# EAGLE schematic boatcc (EAGLE 9.2.1)
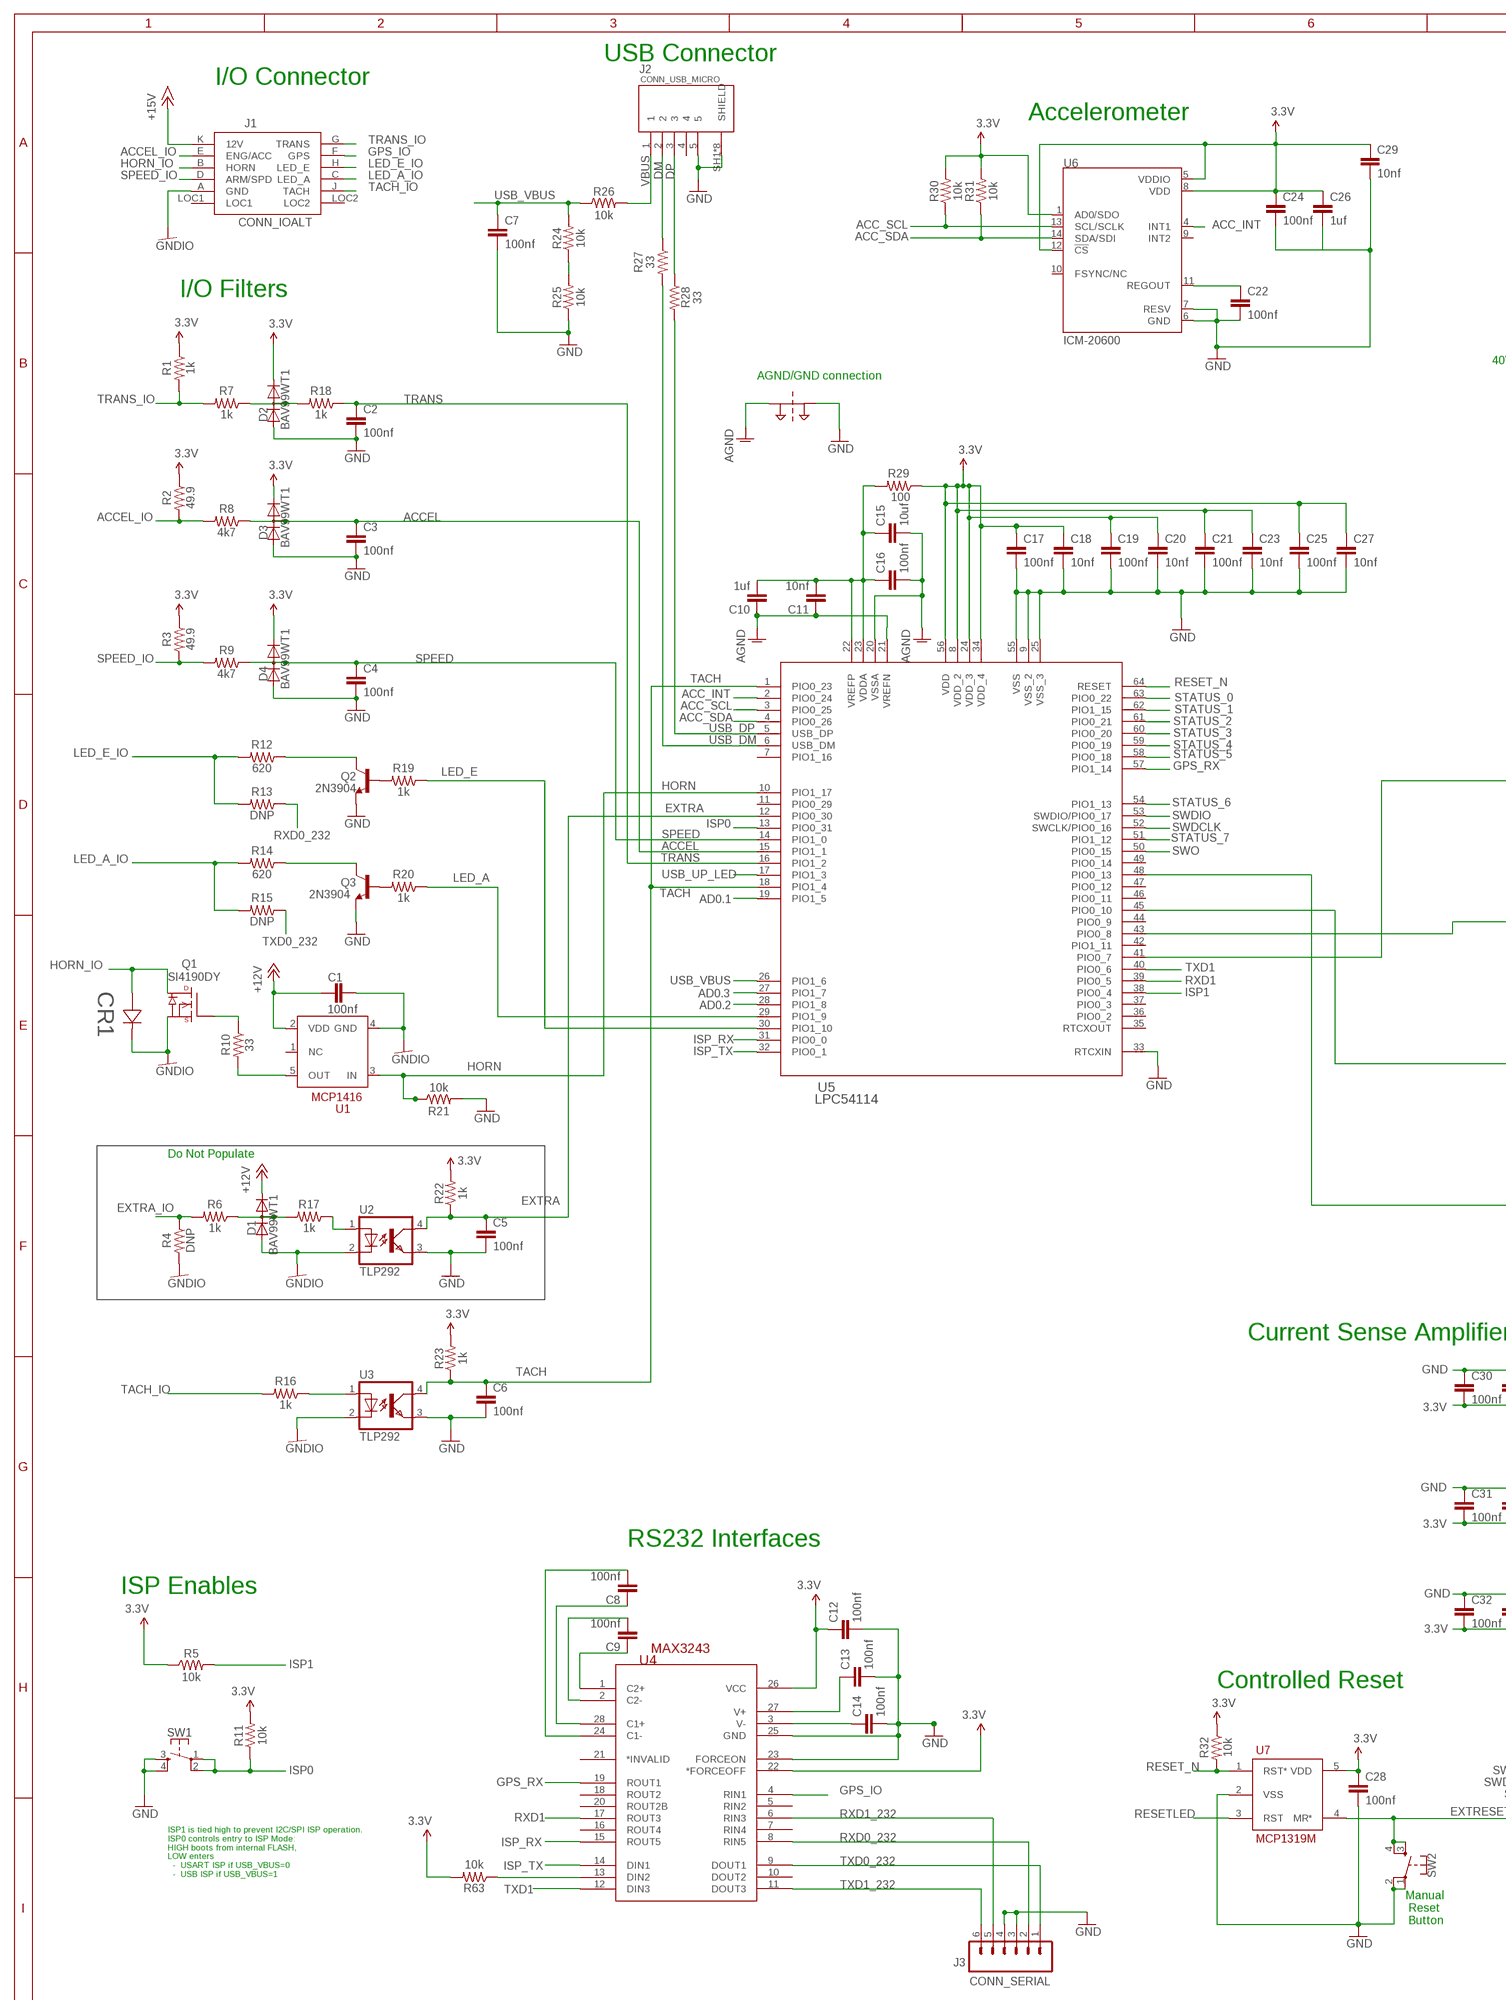
[diagram p0: schematic, sheet 1, part 1 of 2]
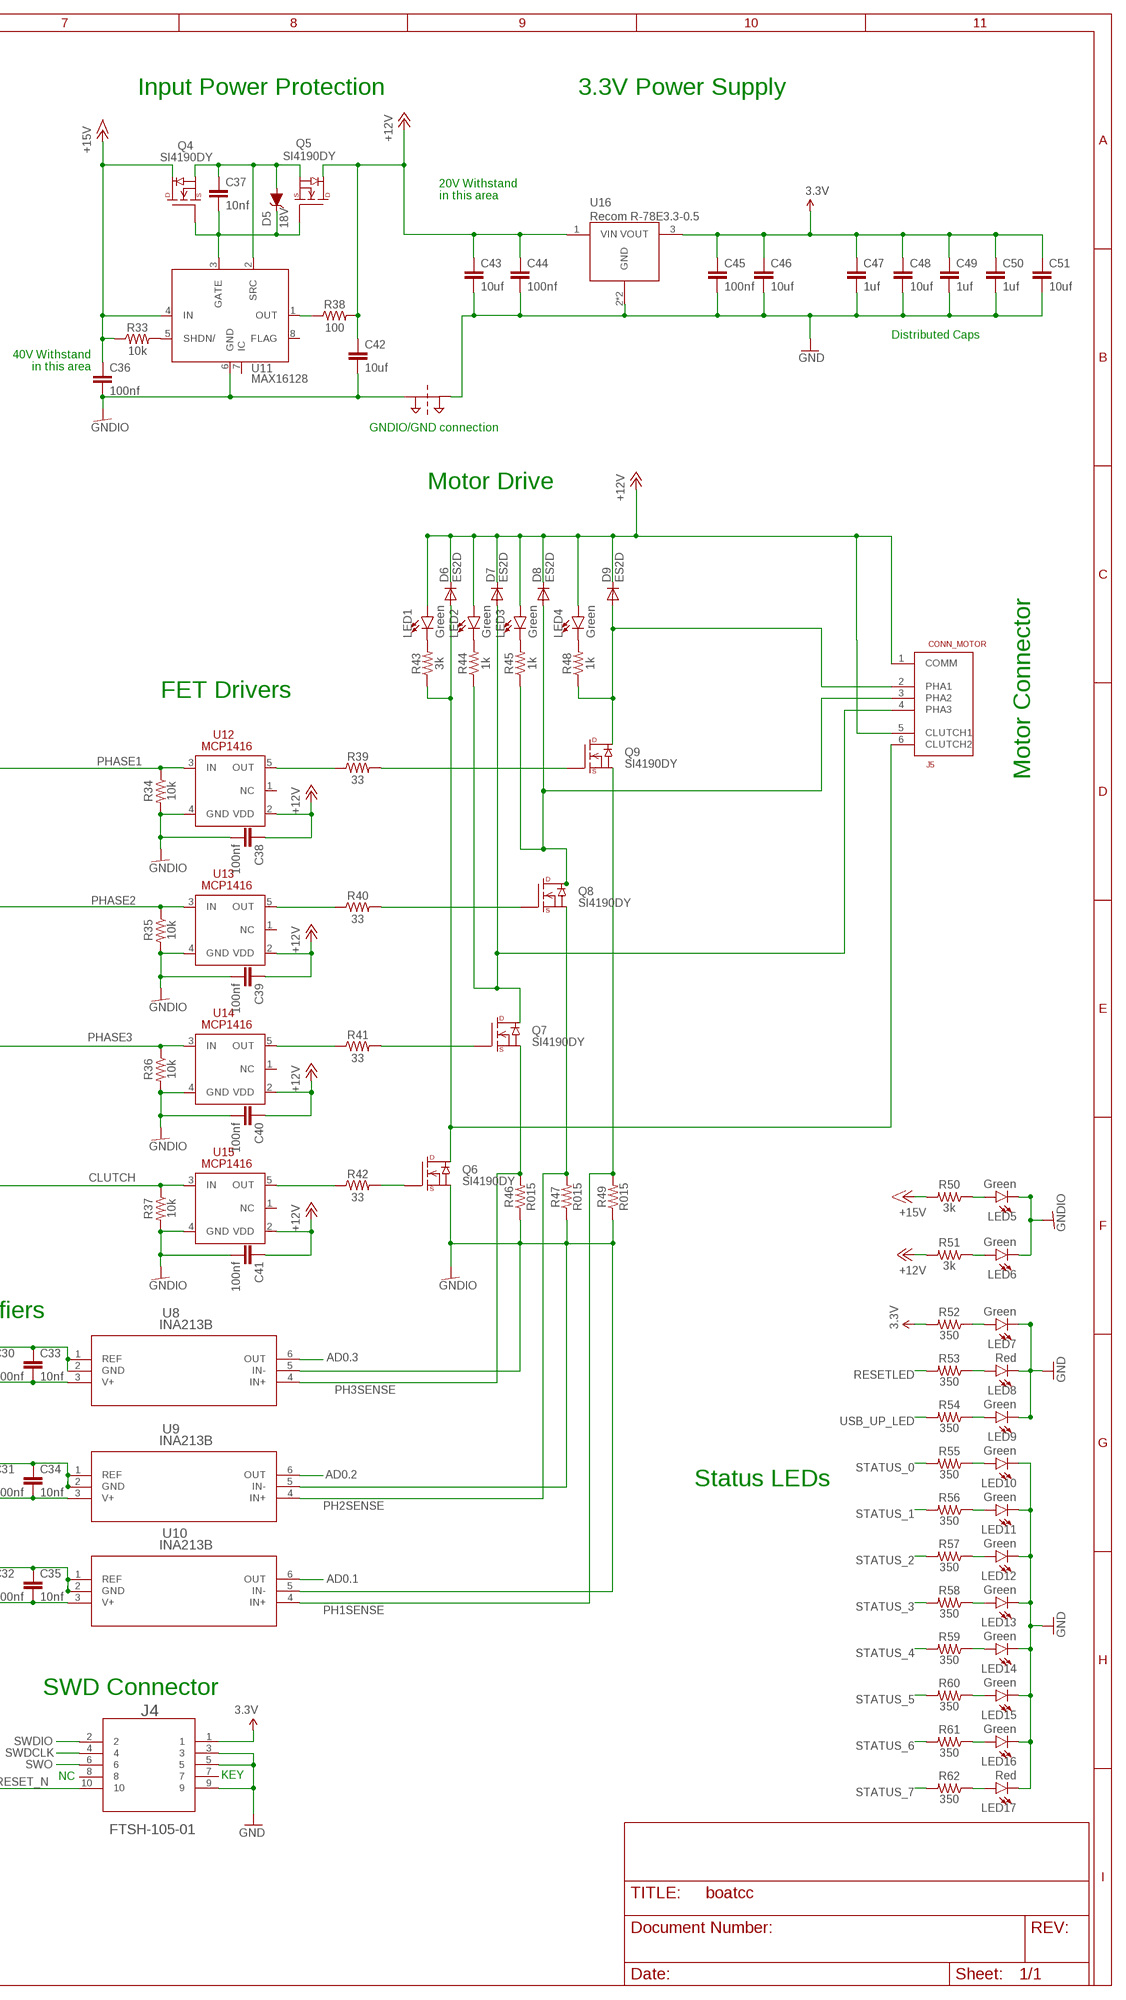
[diagram p1: schematic, sheet 1, part 2 of 2]

## Parts
C1  100nf  1CAP-0805  [0805]
C2  100nf  1CAP-0805  [0805]
C3  100nf  1CAP-0805  [0805]
C4  100nf  1CAP-0805  [0805]
C5  100nf  1CAP-0805  [0805]
C6  100nf  1CAP-0805  [0805]
C7  100nf  1CAP-0805  [0805]
C8  100nf  1CAP-0805  [0805]
C9  100nf  1CAP-0805  [0805]
C10  1uf  1CAP-0805  [0805]
C11  10nf  1CAP-0805  [0805]
C12  100nf  1CAP-0805  [0805]
C13  100nf  1CAP-0805  [0805]
C14  100nf  1CAP-0805  [0805]
C15  10uf  1CAP-0805  [0805]
C16  100nf  1CAP-0805  [0805]
C17  100nf  1CAP-0805  [0805]
C18  10nf  1CAP-0805  [0805]
C19  100nf  1CAP-0805  [0805]
C20  10nf  1CAP-0805  [0805]
C21  100nf  1CAP-0805  [0805]
C22  100nf  1CAP-0805  [0805]
C23  10nf  1CAP-0805  [0805]
C24  100nf  1CAP-0805  [0805]
C25  100nf  1CAP-0805  [0805]
C26  1uf  1CAP-0805  [0805]
C27  10nf  1CAP-0805  [0805]
C28  100nf  1CAP-0805  [0805]
C29  10nf  1CAP-0805  [0805]
C30  100nf  1CAP-0805  [0805]
C31  100nf  1CAP-0805  [0805]
C32  100nf  1CAP-0805  [0805]
C33  10nf  1CAP-0805  [0805]
C34  10nf  1CAP-0805  [0805]
C35  10nf  1CAP-0805  [0805]
C36  100nf  1CAP-0805  [0805]
C37  10nf  1CAP-0805  [0805]
C38  100nf  1CAP-0805  [0805]
C39  100nf  1CAP-0805  [0805]
C40  100nf  1CAP-0805  [0805]
C41  100nf  1CAP-0805  [0805]
C42  10uf  1CAP-0805  [0805]
C43  10uf  1CAP-0805  [0805]
C44  100nf  1CAP-0805  [0805]
C45  100nf  1CAP-0805  [0805]
C46  10uf  1CAP-0805  [0805]
C47  1uf  1CAP-0805  [0805]
C48  10uf  1CAP-0805  [0805]
C49  1uf  1CAP-0805  [0805]
C50  1uf  1CAP-0805  [0805]
C51  10uf  1CAP-0805  [0805]
CR1  SMAJ45CASMASERIES-M  [SMASERIES-M]
D1  BAV99WT1  [SC70]
D2  BAV99WT1  [SC70]
D3  BAV99WT1  [SC70]
D4  BAV99WT1  [SC70]
D5  18V  DIODE-ZENER-MM3Z3V3T1G  [SOD-323]
D6  ES2D  [SMB]
D7  ES2D  [SMB]
D8  ES2D  [SMB]
D9  ES2D  [SMB]
J1  CONN_IOALT  [CONN_IO]
J2  CONN_USB_MICRO  USB_MICRO  [MOLEX_1050170001]
J3  CONN_SERIAL  CONN_06LOCK  [1X06_LOCK]
J4  FTSH-105-01  SAMTEC-FTSH-105-01-X-DVJ  [SAMTEC-FTSH-105-01-X-DV]
J5  CONN_MOTOR  [CONN_MOTOR]
LED1  Green  1LED0805  [LED_0805]
LED2  Green  1LED0805  [LED_0805]
LED3  Green  1LED0805  [LED_0805]
LED4  Green  1LED0805  [LED_0805]
LED5  Green  1LED0805  [LED_0805]
LED6  Green  1LED0805  [LED_0805]
LED7  Green  1LED0805  [LED_0805]
LED8  Red  1LED0805  [LED_0805]
LED9  Green  1LED0805  [LED_0805]
LED10  Green  1LED0805  [LED_0805]
LED11  Green  1LED0805  [LED_0805]
LED12  Green  1LED0805  [LED_0805]
LED13  Green  1LED0805  [LED_0805]
LED14  Green  1LED0805  [LED_0805]
LED15  Green  1LED0805  [LED_0805]
LED16  Green  1LED0805  [LED_0805]
LED17  Red  1LED0805  [LED_0805]
Q1  SI4190DY  [SO-8]
Q2  2N3904  TRANS_NPN-MMBT2222AL  [SOT23-3]
Q3  2N3904  TRANS_NPN-MMBT2222AL  [SOT23-3]
Q4  SI4190DY  [SO-8]
Q5  SI4190DY  [SO-8]
Q6  SI4190DY  [SO-8]
Q7  SI4190DY  [SO-8]
Q8  SI4190DY  [SO-8]
Q9  SI4190DY  [SO-8]
R1  1k  1RES-0805  [0805]
R2  49.9  1RES-0805  [0805]
R3  49.9  1RES-0805  [0805]
R4  DNP  1RES-0805  [0805]
R5  10k  1RES-0805  [0805]
R6  1k  1RES-0805  [0805]
R7  1k  1RES-0805  [0805]
R8  4k7  1RES-0805  [0805]
R9  4k7  1RES-0805  [0805]
R10  33  1RES-0805  [0805]
R11  10k  1RES-0805  [0805]
R12  620  1RES-0805  [0805]
R13  DNP  1RES-0805  [0805]
R14  620  1RES-0805  [0805]
R15  DNP  1RES-0805  [0805]
R16  1k  1RES-0805  [0805]
R17  1k  1RES-0805  [0805]
R18  1k  1RES-0805  [0805]
R19  1k  1RES-0805  [0805]
R20  1k  1RES-0805  [0805]
R21  10k  1RES-0805  [0805]
R22  1k  1RES-0805  [0805]
R23  1k  1RES-0805  [0805]
R24  10k  1RES-0805  [0805]
R25  10k  1RES-0805  [0805]
R26  10k  1RES-0805  [0805]
R27  33  1RES-0805  [0805]
R28  33  1RES-0805  [0805]
R29  100  1RES-0805  [0805]
R30  10k  1RES-0805  [0805]
R31  10k  1RES-0805  [0805]
R32  10k  1RES-0805  [0805]
R33  10k  1RES-0805  [0805]
R34  10k  1RES-0805  [0805]
R35  10k  1RES-0805  [0805]
R36  10k  1RES-0805  [0805]
R37  10k  1RES-0805  [0805]
R38  100  1RES-0805  [0805]
R39  33  1RES-0805  [0805]
R40  33  1RES-0805  [0805]
R41  33  1RES-0805  [0805]
R42  33  1RES-0805  [0805]
R43  3k  1RES-0805  [0805]
R44  1k  1RES-0805  [0805]
R45  1k  1RES-0805  [0805]
R46  R015  1RES-1206  [1206]
R47  R015  1RES-1206  [1206]
R48  1k  1RES-0805  [0805]
R49  R015  1RES-1206  [1206]
R50  3k  1RES-0805  [0805]
R51  3k  1RES-0805  [0805]
R52  350  1RES-0805  [0805]
R53  350  1RES-0805  [0805]
R54  350  1RES-0805  [0805]
R55  350  1RES-0805  [0805]
R56  350  1RES-0805  [0805]
R57  350  1RES-0805  [0805]
R58  350  1RES-0805  [0805]
R59  350  1RES-0805  [0805]
R60  350  1RES-0805  [0805]
R61  350  1RES-0805  [0805]
R62  350  1RES-0805  [0805]
R63  10k  1RES-0805  [0805]
SUPPLY1  2PT_GND_TIE  [2PT_GND_TIE]
SUPPLY2  2PT_GND_TIE  [2PT_GND_TIE]
SW1  MOMENTARY-SWITCH-SPST-2-SMD-5.2MM  [TACTILE_SWITCH_SMD_5.2MM]
SW2  MOMENTARY-SWITCH-SPST-2-SMD-5.2MM  [TACTILE_SWITCH_SMD_5.2MM]
U1  MCP1416  MCP1416SOT-23-5_MCM  [SOT-23-5_MC-M]
U2  TLP292  TLP290  [MINI-FLAT-4]
U3  TLP292  TLP290  [MINI-FLAT-4]
U4  MAX3243  MAX3243_PW_28HEAVY  [PW28-M]
U5  LPC54114  LPC5411XJXXXBD64LQFP64_10X10-M  [LQFP64_10X10-M]
U6  ICM-20600  [PQFN50P250X300X97-14N]
U7  MCP1319M  [SOT23-5]
U8  INA213B  INA213AIDCKRDCK6-M  [DCK6-M]
U9  INA213B  INA213AIDCKRDCK6-M  [DCK6-M]
U10  INA213B  INA213AIDCKRDCK6-M  [DCK6-M]
U11  MAX16128  [UMAX8]
U12  MCP1416  MCP1416SOT-23-5_MCM  [SOT-23-5_MC-M]
U13  MCP1416  MCP1416SOT-23-5_MCM  [SOT-23-5_MC-M]
U14  MCP1416  MCP1416SOT-23-5_MCM  [SOT-23-5_MC-M]
U15  MCP1416  MCP1416SOT-23-5_MCM  [SOT-23-5_MC-M]
U16  Recom R-78E3.3-0.5  LM2931_FIXEDD2PAK/TO263  [D2PACK/A]

## Nets
3.3V: C12.1 C17.1 C18.1 C19.1 C20.1 C21.1 C23.1 C24.1 C25.1 C26.1 C27.1 C28.1 C29.1 C30.2 C31.2 C32.2 C33.2 C34.2 C35.2 C45.1 C46.1 C47.1 C48.1 C49.1 C50.1 C51.1 D2.2(C) D3.2(C) D4.2(C) J4.1 R1.1 R2.1 R3.1 R5.1 R11.2 R22.2 R23.2 R29.1 R30.2 R31.2 R32.1 R52.2 R63.2 U4.22(*FORCEOFF) U4.26(VCC) U5.8(VDD_2) U5.24(VDD_3) U5.34(VDD_4) U5.56(VDD) U6.1(AD0/SDO) U6.5(VDDIO) U6.8(VDD) U6.12(!CS) U7.5(VDD) U8.3(V+) U9.3(V+) U10.3(V+) U16.3(VOUT)
+12V: C1.1 C38.1 C39.1 C40.1 C41.1 C42.1 C43.1 C44.1 D1.2(C) D6.C D7.C D8.C D9.C J5.1(COMM) J5.5(CLUTCH1) LED1.A LED2.A LED3.A LED4.A Q5.5(D) Q5.6(D) Q5.7(D) Q5.8(D) R38.2 R51.2 U1.2(VDD) U12.2(VDD) U13.2(VDD) U14.2(VDD) U15.2(VDD) U16.1(VIN)
+15V: C36.1 J1.K(12V) Q4.5(D) Q4.6(D) Q4.7(D) Q4.8(D) R33.1 R50.2 U11.4(IN)
ACC_INT: U5.2(PIO0_24) U6.4(INT1)
ACC_SCL: R30.1 U5.3(PIO0_25) U6.13(SCL/SCLK)
ACC_SDA: R31.1 U5.4(PIO0_26) U6.14(SDA/SDI)
ACCEL: C3.1 D3.3(AC) R8.1 U5.15(PIO1_1)
ACCEL_IO: J1.E(ENG/ACC) R2.2 R8.2
AD0.1: U5.19(PIO1_5) U10.6(OUT)
AD0.2: U5.28(PIO1_8) U9.6(OUT)
AD0.3: U5.27(PIO1_7) U8.6(OUT)
AGND: C10.1 C11.1 C15.2 C16.2 SUPPLY1.P$1 U5.20(VSSA) U5.21(VREFN)
CLUTCH: R37.1 U5.48(PIO0_13) U15.3(IN)
CLUTCH2: D6.A J5.6(CLUTCH2) Q6.5(D) Q6.6(D) Q6.7(D) Q6.8(D) R43.1
DM: J2.2 R27.1
DP: J2.3 R28.1
EXTRA: C5.1 R22.1 U2.4(COL) U5.12(PIO0_30)
EXTRA_IO: R4.1 R6.2
EXTRESET_N: J4.10 SW2.3 SW2.4 U7.4(MR*)
FILTER_IN1: D1.3(AC) R6.1 R17.2
GND: C2.2 C3.2 C4.2 C5.2 C6.2 C7.2 C12.2 C13.2 C14.2 C17.2 C18.2 C19.2 C20.2 C21.2 C22.2 C23.2 C24.2 C25.2 C26.2 C27.2 C28.2 C29.2 C30.1 C31.1 C32.1 C33.1 C34.1 C35.1 C43.2 C44.2 C45.2 C46.2 C47.2 C48.2 C49.2 C50.2 C51.2 D2.1(A) D3.1(A) D4.1(A) J2.5 J2.SH1(SHIELD) J2.SH2(SHIELD) J2.SH3(SHIELD) J2.SH4(SHIELD) J2.SH5(SHIELD) J2.SH6(SHIELD) J2.SH7(SHIELD) J2.SH8(SHIELD) J3.3 J3.4 J4.3 J4.5 J4.9 LED7.C LED8.C LED9.C LED10.C LED11.C LED12.C LED13.C LED14.C LED15.C LED16.C LED17.C Q2.2(E) Q3.2(E) R21.2 R25.1 SUPPLY1.P$2 SUPPLY2.P$2 SW1.3 SW1.4 SW2.1 SW2.2 U2.3(EMIT) U3.3(EMIT) U4.23(FORCEON) U4.25(GND) U5.9(VSS_2) U5.25(VSS_3) U5.33(RTCXIN) U5.55(VSS) U6.6(GND) U6.7(RESV) U7.2(VSS) U8.1(REF) U8.2(GND) U9.1(REF) U9.2(GND) U10.1(REF) U10.2(GND) U16.2(GND) U16.TAB(GND)
GNDIO: C1.2 C36.2 C38.2 C39.2 C40.2 C41.2 C42.2 CR1.1 D1.1(A) J1.A(GND) LED5.C LED6.C Q1.1(S) Q1.2(S) Q1.3(S) Q6.1(S) Q6.2(S) Q6.3(S) R4.2 R34.2 R35.2 R36.2 R37.2 R46.1 R47.1 R49.1 SUPPLY2.P$1 U1.4(GND) U2.2(C) U3.2(C) U8.5(IN-) U9.5(IN-) U10.5(IN-) U11.6(GND) U12.4(GND) U13.4(GND) U14.4(GND) U15.4(GND)
GPS_IO: J1.F(GPS) U4.4(RIN1)
GPS_RX: U4.19(ROUT1) U5.57(PIO1_14)
HORN: R21.1 U1.3(IN) U5.10(PIO1_17)
HORN_IO: CR1.2 J1.B(HORN) Q1.5(D) Q1.6(D) Q1.7(D) Q1.8(D)
INT_PWR: C37.1 D5.A Q4.1(S) Q4.2(S) Q4.3(S) Q5.1(S) Q5.2(S) Q5.3(S) U11.2(SRC)
ISP0: R11.1 SW1.1 SW1.2 U5.13(PIO0_31)
ISP1: R5.2 U5.38(PIO0_4)
ISP_RX: U4.15(ROUT5) U5.31(PIO0_0)
ISP_TX: U4.14(DIN1) U5.32(PIO0_1)
LED_A: R20.1 U5.29(PIO1_9)
LED_A_IO: J1.C(LED_A) R14.2 R15.2
LED_E: R19.1 U5.30(PIO1_10)
LED_E_IO: J1.H(LED_E) R12.2 R13.2
MOTOR_PHASE_1: D9.A J5.2(PHA1) Q9.5(D) Q9.6(D) Q9.7(D) Q9.8(D) R48.1
MOTOR_PHASE_2: D8.A J5.3(PHA2) Q8.5(D) Q8.6(D) Q8.7(D) Q8.8(D) R45.1
MOTOR_PHASE_3: D7.A J5.4(PHA3) Q7.5(D) Q7.6(D) Q7.7(D) Q7.8(D) R44.1
N$1: R41.1 U14.5(OUT)
N$2: Q2.1(B) R19.2
N$3: R10.2 U1.5(OUT)
N$4: LED1.C R43.2
N$6: Q3.1(B) R20.2
N$8: Q1.4(G) R10.1
N$11: Q7.4(G) R41.2
N$12: LED13.A R58.1
N$13: LED12.A R57.1
N$15: R17.1 U2.1(A)
N$16: R33.2 U11.5(SHDN/)
N$17: C37.2 D5.C Q4.4(G) Q5.4(G) U11.3(GATE)
N$18: R39.1 U12.5(OUT)
N$19: Q9.4(G) R39.2
N$20: R40.1 U13.5(OUT)
N$21: LED5.A R50.1
N$22: LED11.A R56.1
N$26: Q8.4(G) R40.2
N$27: R38.1 U11.1(OUT)
N$28: LED10.A R55.1
N$32: LED8.A R53.1
N$33: LED7.A R52.1
N$34: R42.1 U15.5(OUT)
N$35: Q6.4(G) R42.2
N$37: LED16.A R61.1
N$38: LED2.C R44.2
N$39: LED3.C R45.2
N$40: LED4.C R48.2
N$43: C8.2 U4.24(C1-)
N$44: LED6.A R51.1
N$46: C8.1 U4.28(C1+)
N$47: D2.3(AC) R7.1 R18.2
N$48: C9.2 U4.2(C2-)
N$49: C9.1 U4.1(C2+)
N$50: C22.1 U6.11(REGOUT)
N$53: C13.1 U4.27(V+)
N$54: LED17.A R62.1
N$56: LED9.A R54.1
N$57: Q3.3(C) R14.1
N$58: Q2.3(C) R12.1
N$64: C14.1 U4.3(V-)
N$65: R24.1 R25.2
N$66: R16.1 U3.1(A)
N$69: R63.1 U4.13(DIN2)
N$70: LED15.A R60.1
N$71: LED14.A R59.1
PH1SENSE: Q9.1(S) Q9.2(S) Q9.3(S) R49.2 U10.4(IN+)
PH2SENSE: Q8.1(S) Q8.2(S) Q8.3(S) R47.2 U9.4(IN+)
PH3SENSE: Q7.1(S) Q7.2(S) Q7.3(S) R46.2 U8.4(IN+)
PHASE1: R34.1 U5.41(PIO0_7) U12.3(IN)
PHASE2: R35.1 U5.43(PIO0_8) U13.3(IN)
PHASE3: R36.1 U5.45(PIO0_10) U14.3(IN)
RESET_N: R32.2 U5.64(RESET) U7.1(RST*)
RESETLED: R53.2 U7.3(RST)
RXD0_232: J3.2 R13.1 U4.8(RIN5)
RXD1: U4.17(ROUT3) U5.39(PIO0_5)
RXD1_232: J3.5 U4.6(RIN3)
SPEED: C4.1 D4.3(AC) R9.1 U5.14(PIO1_0)
SPEED_IO: J1.D(ARM/SPD) R3.2 R9.2
STATUS_0: R55.2 U5.63(PIO0_22)
STATUS_1: R56.2 U5.62(PIO1_15)
STATUS_2: R57.2 U5.61(PIO0_21)
STATUS_3: R58.2 U5.60(PIO0_20)
STATUS_4: R59.2 U5.59(PIO0_19)
STATUS_5: R60.2 U5.58(PIO0_18)
STATUS_6: R61.2 U5.54(PIO1_13)
STATUS_7: R62.2 U5.51(PIO1_12)
SWDCLK: J4.4 U5.52(SWCLK/PIO0_16)
SWDIO: J4.2 U5.53(SWDIO/PIO0_17)
SWO: J4.6 U5.50(PIO0_15)
TACH: C6.1 R23.1 U3.4(COL) U5.1(PIO0_23) U5.18(PIO1_4)
TACH_IO: J1.J(TACH) R16.2
TRANS: C2.1 R18.1 U5.16(PIO1_2)
TRANS_IO: J1.G(TRANS) R1.2 R7.2
TXD0_232: J3.1 R15.1 U4.9(DOUT1)
TXD1: U4.12(DIN3) U5.40(PIO0_6)
TXD1_232: J3.6 U4.11(DOUT3)
USB_DM: R27.2 U5.6(USB_DM)
USB_DP: R28.2 U5.5(USB_DP)
USB_UP_LED: R54.2 U5.17(PIO1_3)
USB_VBUS: C7.1 R24.2 R26.1 U5.26(PIO1_6)
VBUS: J2.1 R26.2
VDDA: C10.2 C11.2 C15.1 C16.1 R29.2 U5.22(VREFP) U5.23(VDDA)
Unconnected: J1.LOC1 J1.LOC2 J2.4 J4.7 J4.8 U1.1(NC) U4.5(RIN2) U4.7(RIN4) U4.10(DOUT2) U4.16(ROUT4) U4.18(ROUT2) U4.20(ROUT2B) U4.21(*INVALID) U5.7(PIO1_16) U5.11(PIO0_29) U5.35(RTCXOUT) U5.36(PIO0_2) U5.37(PIO0_3) U5.42(PIO1_11) U5.44(PIO0_9) U5.46(PIO0_11) U5.47(PIO0_12) U5.49(PIO0_14) U6.9(INT2) U6.10(FSYNC/NC) U11.7(IC) U11.8(FLAG) U12.1(NC) U13.1(NC) U14.1(NC) U15.1(NC)

## Notes on the sheet
- USB Connector
- I/O Connector
- Input Power Protection | 3.3V Power Supply
- Accelerometer
- 20V Withstand
  in this area
- I/O Filters
- Distributed Caps
- 40V Withstand
  in this area
- AGND/GND connection
- GNDIO/GND connection
- Motor Drive
- FET Drivers
- Motor Connector
- Do Not Populate
- Current Sense Amplifiers
- Status LEDs
- RS232 Interfaces
- ISP Enables
- Controlled Reset
- SWD Connector
- NC | KEY
- ISP1 is tied high to prevent I2C/SPI ISP operation.
  ISP0 controls entry to ISP Mode:
  HIGH boots from internal FLASH, 
  LOW enters 
    -  USART ISP if USB_VBUS=0
    -  USB ISP if USB_VBUS=1
- Manual
   Reset
   Button

## Library data of the parts
C1-C51 = BoatCC:1CAP: Ceramic capacitor A capacitor is a passive two-terminal electrical component used to store electrical energy temporarily in an electric field.; VALUE: 0
CR1 = BoatCC:SMAJ45CA; DIGI-KEY_PART_NUMBER: SMAJ24CALFCT-ND; DIGI-KEY_PURCHASE_URL: https://www.digikey.com/product-detail/en/littelfuse-inc/SMAJ24CA/SMAJ24CALFCT-ND/762501; MANUFACTURER_PART_NUMBER: SMAJ24CA; VENDOR: Littelfuse Inc
D1-D4 = BoatCC:BAV99WT1: Dual Series Switching Diode; DIGI-KEY_PART_NUMBER: BAV99WT1GOSCT-ND; DIGI-KEY_PURCHASE_URL: https://www.digikey.com/product-detail/en/on-semiconductor/BAV99WT1G/BAV99WT1GOSCT-ND/917823; MF: ON Semiconductor; MP: BAV99WT1G
D5 = BoatCC:DIODE-ZENER: Zener Diode A Zener diode allows current to flow from its anode to its cathode like a normal semiconductor diode, but it also permits current to flow in the reverse direction when its "Zener voltage" is reached. - WIkipedia; DIGI-KEY_PART_NUMBER: MM3Z18VT1GOSCT-ND; DIGI-KEY_PURCHASE_URL: https://www.digikey.com/product-detail/en/on-semiconductor/MM3Z18VT1G/MM3Z18VT1GOSCT-ND/2121059; MF: ON Semiconductor; MP: MM3Z18VT1G
D6-D9 = BoatCC:ES2D: DIODE super fast rectifier, 2 A; DIGI-KEY_PART_NUMBER: ES2DFSCT-ND; DIGI-KEY_PURCHASE_URL: https://www.digikey.com/product-detail/en/on-semiconductor/ES2D/ES2DFSCT-ND/458941; MF: ON Semiconductor; MP: ES2D
J1 = BoatCC:CONN_IO
J2 = BoatCC:USB_MICRO: USB Micro-B SMT connector; DIGI-KEY_PART_NUMBER: WM1399CT-ND; DIGI-KEY_PURCHASE_URL: https://www.digikey.com/product-detail/en/molex-llc/1050170001/WM1399CT-ND/2350885?utm_source=snapeda&utm_medium=aggregator&utm_campaign=symbol; MF: Molex, LLC; MP: 1050170001
J3 = BoatCC:CONN_06: 6-pin 0.1" header
J4 = BoatCC:SAMTEC-FTSH-105-01-X-DV: 2x5 Connector for SWD; DIGI-KEY_PART_NUMBER: SAM13933CT-ND; DIGI-KEY_PURCHASE_URL: https://www.digikey.com/product-detail/en/samtec-inc/FTSH-105-01-L-DV-007-P-TR/SAM13933CT-ND/9594226?utm_source=snapeda&utm_medium=aggregator&utm_campaign=symbol; MF: Samtec Inc.; MP: FTSH-105-01-L-DV-007-P-TR
J5 = BoatCC:CONN_MOTOR
LED1-LED7 LED9-LED16 = BoatCC:1LED: LED (Generic) Standard schematic elements and footprints for 5mm, 3mm, 1206, and 0603 sized LEDs. Generic LEDs with no color specified.; DIGI-KEY_PART_NUMBER: 732-4986-1-ND; DIGI-KEY_PURCHASE_URL: https://www.digikey.com/product-detail/en/wurth-electronics-inc/150080VS75000/732-4986-1-ND/4489922; MF: WURTH Electronics; MP: 150080VS75000
LED8 LED17 = BoatCC:1LED: LED (Generic) Standard schematic elements and footprints for 5mm, 3mm, 1206, and 0603 sized LEDs. Generic LEDs with no color specified.; DIGI-KEY_PART_NUMBER: 732-4984-1-ND; DIGI-KEY_PURCHASE_URL: https://www.digikey.com/product-detail/en/wurth-electronics-inc/150080RS75000/732-4984-1-ND/4489916; MF: WURTH Electronics; MP: 150080RS75000
Q1 Q4-Q9 = BoatCC:SI4190DY: Vishay SI4190DY FET; DIGI-KEY_PART_NUMBER: SI4190ADY-T1-GE3; DIGI-KEY_PURCHASE_URL: https://www.digikey.com/product-detail/en/vishay-siliconix/SI4190ADY-T1-GE3/SI4190ADY-T1-GE3CT-ND/3178403; MF: Vishay Siliconix; MP: SI4190ADY-T1-GE3
Q2 Q3 = BoatCC:TRANS_NPN: NPN transistor Current controlled devices typically used to amplify current or used as a switch. BC547 - COM-08928 <http://www.sparkfun.com/products/8928> (TO-92 45V 100mA) (1.Collector 2.Base 3.Emitter) 2N3904 - COM-00521 <http://www.sparkfun.com/products/521> (TO-92 40V 200mA) (1.Emitter 2.Base 3.Collector) P2N2222A - COM-12852 <http://www.sparkfun.com/products/12852> (TO-92 40V 600mA) (1.Collector 2.Base 3.Emitter); DIGI-KEY_PART_NUMBER: MMBT2222AWT1GOSCT-ND; DIGI-KEY_PURCHASE_URL: https://www.digikey.com/product-detail/en/on-semiconductor/MMBT2222AWT1G/MMBT2222AWT1GOSCT-ND/1139807; MF: ON Semiconductor; MP: MMBT2222AWT1G
R1-R45 R48 R50-R63 = BoatCC:1RES: Resistor A resistor is a passive two-terminal electrical component that implements electrical resistance as a circuit element. Resistors act to reduce current flow, and, at the same time, act to lower voltage levels within circuits. - Wikipedia
R46 R47 R49 = BoatCC:1RES: Resistor A resistor is a passive two-terminal electrical component that implements electrical resistance as a circuit element. Resistors act to reduce current flow, and, at the same time, act to lower voltage levels within circuits. - Wikipedia; DIGI-KEY_PART_NUMBER: 408-1572-1-ND; DIGI-KEY_PURCHASE_URL: https://www.digikey.com/product-detail/en/susumu/KRL1632E-M-R015-F-T5/408-1572-1-ND/3737754; VALUE: 10k
SUPPLY1 SUPPLY2 = BoatCC:2PT_GND_TIE: Dual Ground Supply Power supply symbol for connecting two grounds. SparkFun Products: SparkFun AutoDriver - Stepper Motor Driver <https://www.sparkfun.com/products/11611>
SW1 SW2 = BoatCC:MOMENTARY-SWITCH-SPST-2: Momentary Switch (Pushbutton) - SPST - Two Circuits Normally-open (NO) SPST momentary switches (buttons, pushbuttons). Schematic symbol includes two switch circuits. Variants SMD-4.6MMX2.8MM - 4.60mm x 2.80mm Tactile Momentary Button Switch - Used on SparkFun SAMD21 Mini Breakout <https://www.sparkfun.com/products/13664> SMD-5.2MM - Mini Pushbutton Switch - SMD <https://www.sparkfun.com/products/8720> - Used on Arduino Pro Mini <https://www.sparkfun.com/products/11114>; DIGI-KEY_PART_NUMBER: CKN9104CT-ND; DIGI-KEY_PURCHASE_URL: https://www.digikey.com/product-detail/en/c-k/PTS525SM15SMTR2-LFS/CKN9104CT-ND/1146923; MF: C&K; MP: PTS525SM15SMTR2 LFS
U1 U12-U15 = BoatCC:MCP1416: FET Driver; DIGI-KEY_PART_NUMBER: MCP1416T-E/OTCT-ND; DIGI-KEY_PURCHASE_URL: https://www.digikey.com/product-detail/en/microchip-technology/MCP1416T-E-OT/MCP1416T-E-OTCT-ND/1963940; MF: Microchip Technology; MP: MCP1416T-E/OTCT-ND
U2 U3 = BoatCC:TLP290: TOSHIBA PHOTOCOUPLER GaAs IRED & PHOTO-TRANSISTOR Source: http://www.semicon.toshiba.co.jp/td/en/Opto/Photocoupler/en_20050928_TLP283_datasheet.pdf; DIGI-KEY_PART_NUMBER: TLP292(GB-TPLECT-ND; DIGI-KEY_PURCHASE_URL: https://www.digikey.com/product-detail/en/toshiba-semiconductor-and-storage/TLP292-GB-TPLE/TLP292-GB-TPLECT-ND/4562959; MF: Toshiba Semiconductor; MP: TLP292(GB-TPL,E
U4 = BoatCC:MAX3243_PW_28: RS-232 Transceiver; DIGI-KEY_PART_NUMBER: 296-19809-1-ND; DIGI-KEY_PURCHASE_URL: https://www.digikey.com/product-detail/en/texas-instruments/MAX3243EIDWR/296-19809-1-ND/1120550; MF: Texas Instruments; MP: MAX3243EIDWR
U5 = BoatCC:LPC5411XJXXXBD64: Microprocessor; DIGI-KEY_PART_NUMBER: 568-13034-ND; DIGI-KEY_PURCHASE_URL: https://www.digikey.com/product-detail/en/nxp-usa-inc/LPC54114J256BD64QL/568-13034-ND/5981474; MF: NXP; MP: LPC54114J256BD64QL
U6 = BoatCC:ICM-20600: Low-Power, High-Performance Integrated 6-Axis MEMS MotionTracking Device in 2.5mm x 3mm Package; DIGI-KEY_PART_NUMBER: 1428-1147-1-ND; DIGI-KEY_PURCHASE_URL: https://www.digikey.com/product-detail/en/tdk-invensense/ICM-20600/1428-1147-1-ND/9602942?utm_source=snapeda&utm_medium=aggregator&utm_campaign=symbol; MF: TDK InvenSense; MP: ICM-20600
U7 = BoatCC:MCP1319M: Supervisor/Controlled Reset IC; DIGI-KEY_PART_NUMBER: MCP1319MT-29LE/OTCT-ND; DIGI-KEY_PURCHASE_URL: https://www.digikey.com/product-detail/en/microchip-technology/MCP1319MT-29LE-OT/MCP1319MT-29LE-OTCT-ND/1979885; MF: Microchip Technology; MP: MCP1319MT-29LE/OT
U8-U10 = BoatCC:INA213AIDCKR; DIGI-KEY_PART_NUMBER: 296-40129-1-ND; DIGI-KEY_PURCHASE_URL: https://www.digikey.com/product-detail/en/texas-instruments/INA213BIDCKR/296-40129-1-ND/5178006; MANUFACTURER_PART_NUMBER: INA213BIDCKR; VENDOR: Texas Instruments
U11 = BoatCC:MAX16128: Load Dump/Reverse Voltage Protection Circuit; MF: MAXIM; MOUSER_PART_NUMBER: 700-MAX16128UAACAC+T; MOUSER_PURCHASE_URL: https://www.mouser.com/ProductDetail/Maxim-Integrated/MAX16128UAACAC%2bT?qs=sGAEpiMZZMu1UliJf38%252bvJdNBX%2fRahf2; MP: MAX16129UADFD+
U16 = BoatCC:LM2931_FIXED: LDO regulator with reverse battery protection- very durable!; ALT_DIGI-KEY_PART_NUMBER: 945-1661-5-ND; ALT_DIGI-KEY_PURCHASE_URL: https://www.digikey.com/product-detail/en/recom-power/R-78E3.3-0.5/945-1661-5-ND/3593412; DIGI-KEY_PART_NUMBER: 497-5225-1-ND; DIGI-KEY_PURCHASE_URL: https://www.digikey.com/product-detail/en/stmicroelectronics/LF33ABDT-TR/497-5225-1-ND/1121678; MF: STMicroelectronics; MP: LF33ABDT-TR